# Altium schematic sheet p09_memory.SchDoc
size A
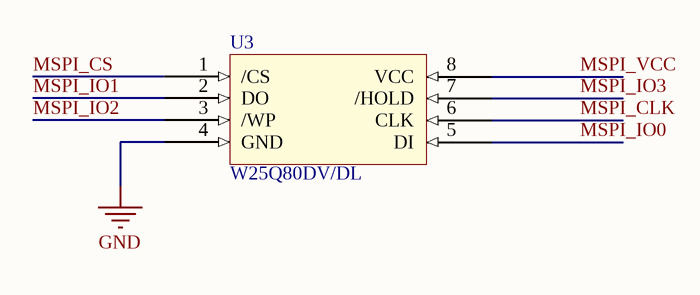
[diagram p0: p09_memory.SchDoc]

## Parts
U3  W25Q80DV/DL  [SOIC127P600X175-8N]

## Nets
GND: U3.4(GND)
MSPI_CLK: U3.6(CLK)
MSPI_CS: U3.1(/CS)
MSPI_IO0: U3.5(DI)
MSPI_IO1: U3.2(DO)
MSPI_IO2: U3.3(/WP)
MSPI_IO3: U3.7(/HOLD)
MSPI_VCC: U3.8(VCC)

## Library data of the parts
U3 = W25Q80DV/DL: 2.5V AND 3V 8M-BIT  SERIAL FLASH MEMORY WITH  DUAL AND QUAD SPI